# Altium schematic sheet ATB-Power.SchDoc
size A4
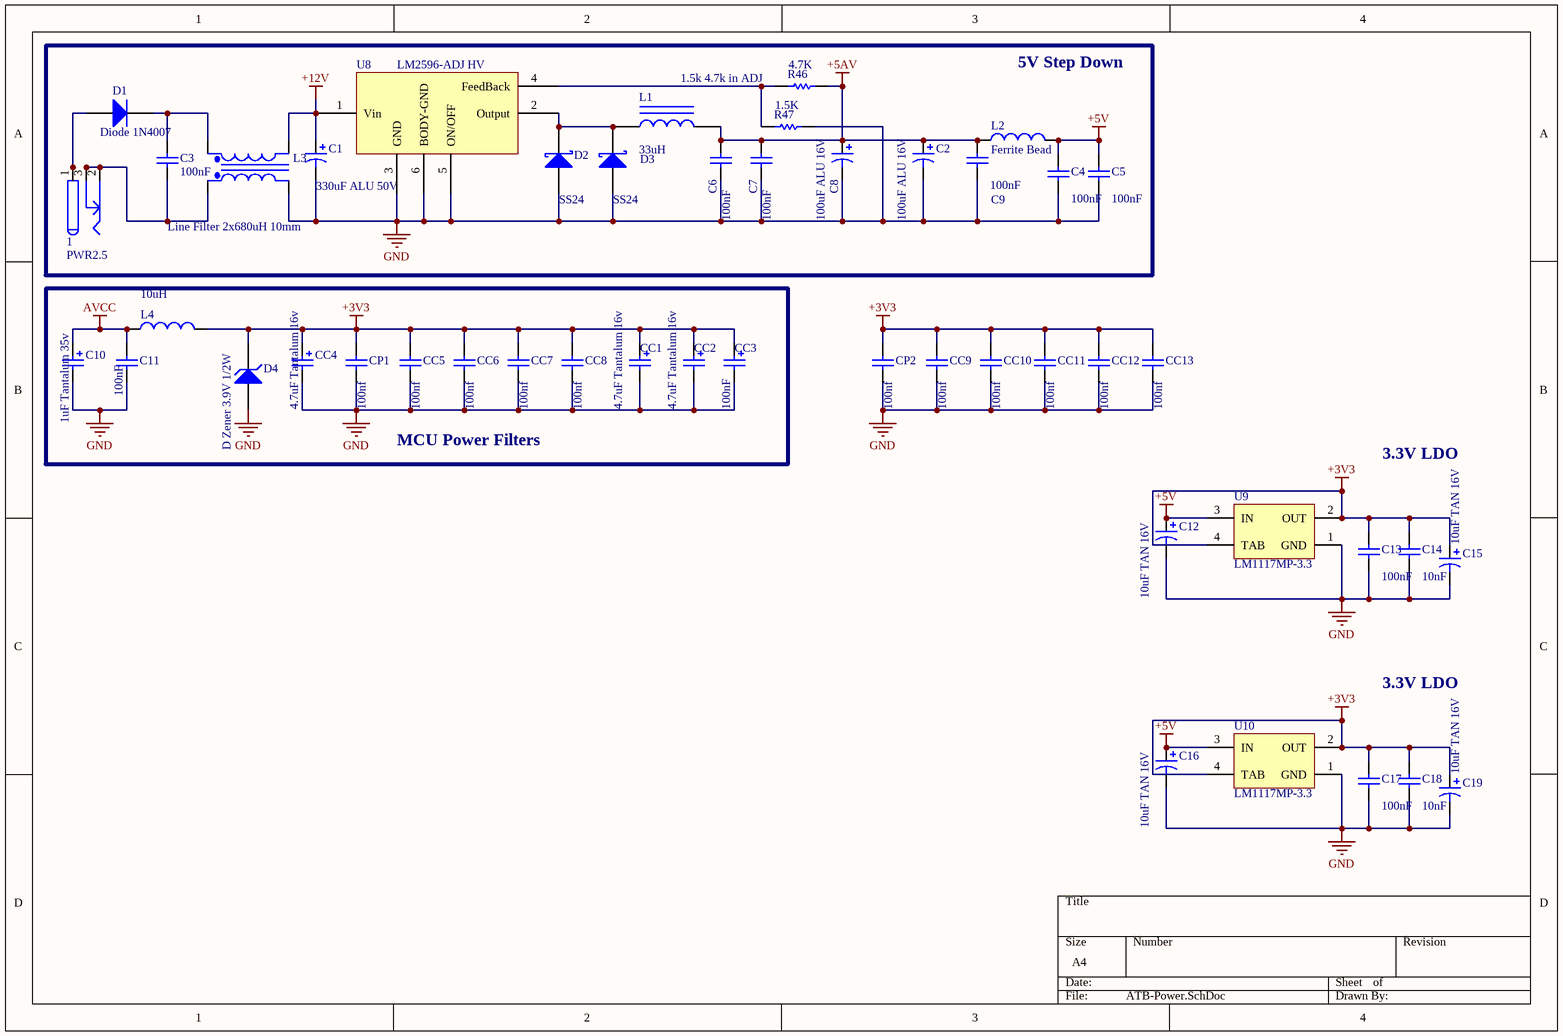
[diagram p0: ATB-Power.SchDoc]

## Parts
1  PWR2.5  [KLD-0202]
C1  330uF ALU 50V  [SMD_CAP_10X10]
C2  100uF ALU 16V  [SMD_CAP_6X6_B6]
C3  100nF  [SMD_C0805]
C4  100nF  [SMD_C0805]
C5  100nF  [SMD_C0805]
C6  100nF  [SMD_C0805]
C7  100nF  [SMD_C0805]
C8  100uF ALU 16V  [SMD_CAP_6X6_B6]
C9  100nF  [SMD_C0805]
C10  1uF Tantalum 35v  [SMD_C3528-P]
C11  100nF  [SMD_C0805]
C12  10uF TAN 16V  [SMD_CAP_6X6_B6]
C13  100nF  [SMD_C0805]
C14  10nF  [SMD_C0805]
C15  10uF TAN 16V  [SMD_CAP_6X6_B6]
C16  10uF TAN 16V  [SMD_CAP_6X6_B6]
C17  100nF  [SMD_C0805]
C18  10nF  [SMD_C0805]
C19  10uF TAN 16V  [SMD_CAP_6X6_B6]
CC1  4.7uF Tantalum 16v  [SMD_C3528-P]
CC2  4.7uF Tantalum 16v  [SMD_C3528-P]
CC3  100nF  [SMD_C0805]
CC4  4.7uF Tantalum 16v  [SMD_C3528-P]
CC5  100nf  [SMD_C0805]
CC6  100nf  [SMD_C0805]
CC7  100nf  [SMD_C0805]
CC8  100nf  [SMD_C0805]
CC9  100nf  [SMD_C0805]
CC10  100nf  [SMD_C0805]
CC11  100nf  [SMD_C0805]
CC12  100nf  [SMD_C0805]
CC13  100nf  [SMD_C0805]
CP1  100nf  [SMD_C0805]
CP2  100nf  [SMD_C0805]
D1  Diode 1N4007  [M7-4007]
D2  SS24  [D_SMA]
D3  SS24  [D_SMA]
D4  D Zener 3.9V 1/2W  [DL-35]
L1  33uH  [SMD_IND_12X12]
L2  Ferrite Bead  [SMD_C1206]
L3  Line Filter 2x680uH 10mm  [CN_FILTE]
L4  10uH  [6-0805_N]
R46  4.7K  [SMD_R0805]
R47  1.5K  [SMD_R0805]
U8  LM2596-ADJ HV  [SMD-5pin-reg]
U9  LM1117MP-3.3  [MP04A_N]
U10  LM1117MP-3.3  [MP04A_N]

## Blocks framed on the sheet
5V Step Down: 1 C1-C9 D1-D3 L1-L3 R46 R47 U8
MCU Power Filters: C10 C11 CC1-CC8 CP1 D4 L4

## Nets
+3V3: C13.2 C14.2 C15.1 C17.2 C18.2 C19.1 CC1.1 CC2.1 CC3.1 CC4.1 CC5.1 CC6.1 CC7.1 CC8.1 CC9.1 CC10.1 CC11.1 CC12.1 CC13.1 CP1.1 CP2.1 D4.2(K) L4.2 U9.2(OUT) U9.4(TAB) U10.2(OUT) U10.4(TAB)
+5AV: C2.1 C6.2 C7.2 C8.1 C9.2 L1.2 L2.1 R46.2
+5V: C4.2 C5.2 C12.1 C16.1 L2.2 U9.3(IN) U10.3(IN)
+12V: C1.1 L3.4(Sec-) U8.1(Vin)
AVCC: C10.1 C11.1 L4.1
GND: C1.2 C2.2 C4.1 C5.1 C6.1 C7.1 C8.2 C9.1 C10.2 C11.2 C12.2 C13.1 C14.1 C15.2 C16.2 C17.1 C18.1 C19.2 CC1.2 CC2.2 CC3.2 CC4.2 CC5.2 CC6.2 CC7.2 CC8.2 CC9.2 CC10.2 CC11.2 CC12.2 CC13.2 CP1.2 CP2.2 D2.1(A) D3.1(A) D4.1(A) L3.2(Pri-) R47.1 U8.3(GND) U8.5(ON/OFF) U8.6(BODY-GND) U9.1(GND) U10.1(GND)
Net1_1: 1.1 1.1A 1.1B D1.1(A)
Net1_2: 1.2 1.2A 1.2B 1.3 1.3A 1.3B C3.1 L3.1(Pri+)
NetC3_2: C3.2 D1.2(K) L3.3(Sec+)
NetD2_2: D2.2(K) D3.2(K) L1.1 U8.2(Output)
NetR46_1: R46.1 R47.2 U8.4(FeedBack)

## Notes on the sheet
- (near R46) 1.5k 4.7k in ADJ
- 3.3V LDO

## Library data of the parts
1 = PWR2.5: Low Voltage Power Supply Connector; Published: 17-Dec-2003; DatasheetDocument: 09-May-2002; Publisher: Altium Limited; ComponentLink1Description: Manufacturer Link; ComponentLink1URL: http://domino.kycon.com/internet/Products.html
C1 C2 C8 C12 C15 C16 C19 = Cap Pol1: Polarized Capacitor (Radial); Published: 8-Jun-2000; LatestRevisionDate: 17-Jul-2002; LatestRevisionNote: Re-released for DXP Platform.; PackageReference: RB7.6-15; Publisher: Altium Limited; PackageDescription: Polarized Capacitor (Radial); 2 Leads
  C1: Value: 330uF
  C2 C8: Value: 100uF
  C12 C15 C16 C19: Value: 10uF
C3-C7 C9 C11 C13 C14 C17 C18 CC5-CC13 CP1 CP2 = Cap: Capacitor; Published: 8-Jun-2000; LatestRevisionDate: 17-Jul-2002; LatestRevisionNote: Re-released for DXP Platform.; PackageReference: RAD-0.3; Publisher: Altium Limited; PackageDescription: Radial Cap, Thru-Hole; 2 Leads; 0.3 in Pin Spacing
  C3-C7 C9 C11 C13 C17 CC5-CC13 CP1 CP2: Value: 100nF
  C14 C18: Value: 10nF
C10 CC1-CC4 = Cap Pol2: Polarized Capacitor (Axial); Published: 8-Jun-2000; LatestRevisionDate: 17-Jul-2002; LatestRevisionNote: Re-released for DXP Platform.; PackageReference: POLAR0.8; Publisher: Altium Limited; PackageDescription: Polarized Capacitor; 2 Leads
  C10: Value: 1uF
  CC1 CC2 CC4: Value: 4.7uF
  CC3: Value: 100nF
D1 = Diode 1N4007: 1 Amp General Purpose Rectifier; Published: 8-Jun-2000; LatestRevisionDate: 17-Jul-2002; LatestRevisionNote: Re-released for DXP Platform.; DatasheetVersion: 1998; PackageVersion: Aug-1999; PackageReference: DO-41; Publisher: Altium Limited; PackageDescription: Diode, Axial; Body 5.2 x 2.7 mm (LxDia. max), Lead Dia. 0.86 mm (max); Code_JEDEC: DO-204-AL; ComponentLink1Description: Manufacturer Link; ComponentLink1URL: http://www.fairchildsemi.com/; ComponentLink2Description: Datasheet; ComponentLink2URL: http://www.fairchildsemi.com/ds/1N%2F1N4001.pdf
D2 D3 = D Schottky: Schottky Diode; Published: 8-Jun-2000; LatestRevisionDate: 17-Jul-2002; LatestRevisionNote: Re-released for DXP Platform.; PackageReference: SMB; Publisher: Altium Limited; PackageDescription: DO-214-AA/SMB; 2 C-Bend Leads; Body 5.3 x 3.6 mm, inc. leads (LxW); Code_JEDEC: DO-214-AA
D4 = D Zener: Zener Diode; Published: 8-Jun-2000; LatestRevisionDate: 17-Jul-2002; LatestRevisionNote: Re-released for DXP Platform.; PackageReference: DIODE-0.7; Publisher: Altium Limited; PackageDescription: Diode, Thru-Hole; 2 Leads; 0.7 in Pin Spacing
L1 = Inductor Iron: Magnetic-Core Inductor; Published: 24-Mar-1999; LatestRevisionDate: 17-Jul-2002; LatestRevisionNote: Re-released for DXP Platform.; PackageReference: AXIAL-0.9; Publisher: Altium Limited; PackageDescription: Axial Device, Thru-Hole; 2 Leads; 0.9 in Pin Spacing; Value: 33uH
L2 = Inductor: Code_IEC: 1005; Value: 10mH; Published: 8-Jun-2000; LatestRevisionDate: 29-May-2009; LatestRevisionNote: IPC-7351 Footprint Added.; PackageReference: 0402-A; Publisher: Altium Limited; PackageDescription: Chip Inductor; Code_JEITA: 0402
L3 = Trans Eq: Transformer (Equivalent Circuit Model); pin to pad: 1>4 4>1; Published: 8-Jun-2000; LatestRevisionDate: 17-Jul-2002; LatestRevisionNote: Re-released for DXP Platform.; PackageReference: TRF_4; Publisher: Altium Limited; PackageDescription: Transformer; 4 Leads
L4 = Inductor: Code_IEC: 1005; Published: 8-Jun-2000; LatestRevisionDate: 29-May-2009; LatestRevisionNote: IPC-7351 Footprint Added.; PackageReference: 0402-A; Publisher: Altium Limited; PackageDescription: Chip Inductor; Code_JEITA: 0402; Value: 10uH
R46 R47 = Res1: Resistor; Published: 8-Jun-2000; LatestRevisionDate: 17-Jul-2002; LatestRevisionNote: Re-released for DXP Platform.; PackageReference: AXIAL-0.3; Publisher: Altium Limited; PackageDescription: Axial Device, Thru-Hole; 2 Leads; 0.3 in Pin Spacing
  R46: Value: 4.7K
  R47: Value: 1.5K
U8 = LM2596-5v
U9 U10 = LM1117MP-3.3: 800mA Low-Dropout Linear Regulator, 4-pin SOT-223; Manufacturer: National Semiconductor; PackageTopMarking: XYTT*N05A; PowerWise: N; CompType: LDO IC; Published: 4-Dec-2008; DatasheetVersion: Apr-2006; PackageVersion: revB, Apr-2003; PackageReference: MP04A; Publisher: Altium Limited; PackageDescription: Molded SOT-223, 6.50 x 3.56 x 1.6mm Body, 4 Lead, 2.3mm Pitch; Supplier 1: Farnell; Supplier Part Number 1: 9778195; Supplier 2: Farnell; Supplier Part Number 2: 9778195RL; PartNumber: LM1117MP-3.3; RoHS: N; PinCount: 4; Code_JEDEC: TO-261-AA; Code_IPC: SOT223-4; ComponentLink1Description: LM1117 Datasheet; ComponentLink1URL: http://www.national.com/ds/LM/LM1117.pdf; ComponentLink2Description: LM1117 Web Page; ComponentLink2URL: http://www.national.com/pf/LM/LM1117.html; ComponentLink3Description: MP04A Package Page; ComponentLink3URL: http://www.national.com/packaging/folders/mp04a.html